# EAGLE design WingboardT (EAGLE 6.2)
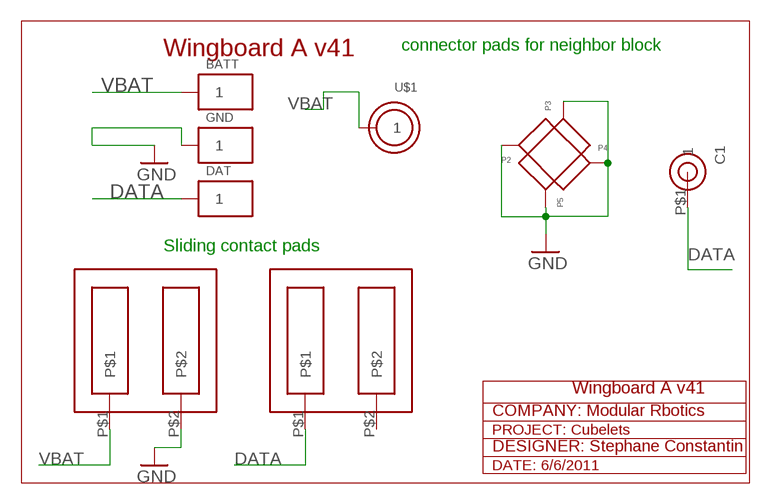
[diagram p0: schematic, sheet 1]

## Parts
BATT  PAD2  [PAD2]
C1  COMM_PIN2  [COMM_PIN2]
DAT  PAD2  [PAD2]
GND  PAD2  [PAD2]
J1  SLIDING_CONTACT  [SLIDING_CONTACT]
J2  SLIDING_CONTACT  [SLIDING_CONTACT]
P2  GND_PAD_WING  [GND_PAD_WING]
P3  GND_PAD_WING  [GND_PAD_WING]
P4  GND_PAD_WING  [GND_PAD_WING]
P5  GND_PAD_WING  [GND_PAD_WING]
U$1  VBAT_CIRCLE  [VBAT_CIRCLE]

## Nets
DATA: C1.P$1 DAT.P$1 J2.P$1
GND: GND.P$1 J1.P$2 P2.P$1 P3.P$1 P4.P$1 P5.P$1
VBAT: BATT.P$1 J1.P$1 U$1.P$1
Unconnected: J2.P$2

## Notes on the sheet
- connector pads for neighbor block
- Wingboard A v41
- Sliding contact pads
- Wingboard A v41
- COMPANY: Modular Rbotics
- PROJECT: Cubelets
- DESIGNER: Stephane Constantin
- DATE: 6/6/2011

## Library data of the parts
BATT DAT GND = roblocks:PAD2
C1 = roblocks:COMM_PIN2
J1 J2 = nev:SLIDING_CONTACT
P2-P5 = roblocks:GND_PAD_WING
U$1 = roblocks:VBAT_CIRCLE

## Board
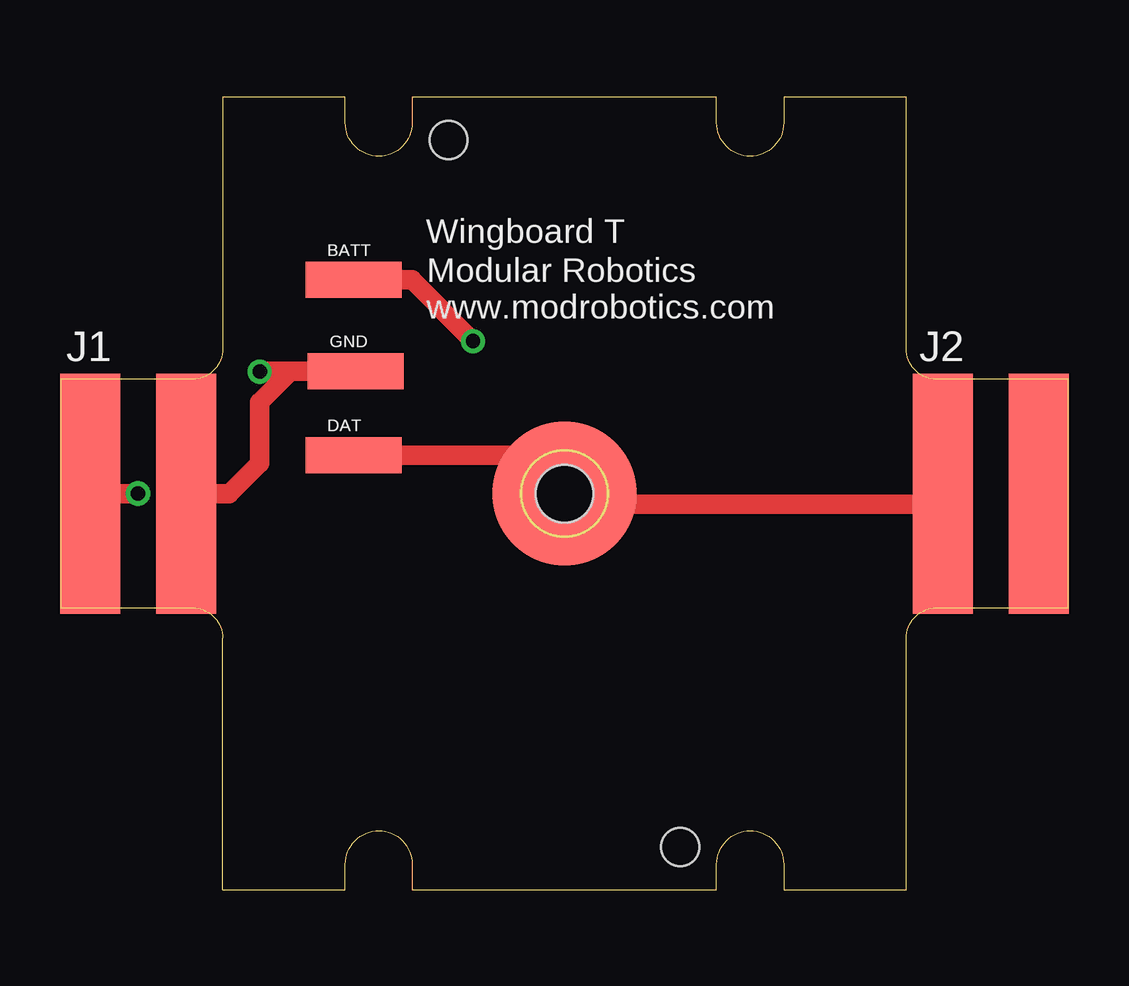
[diagram p1: board, top side]
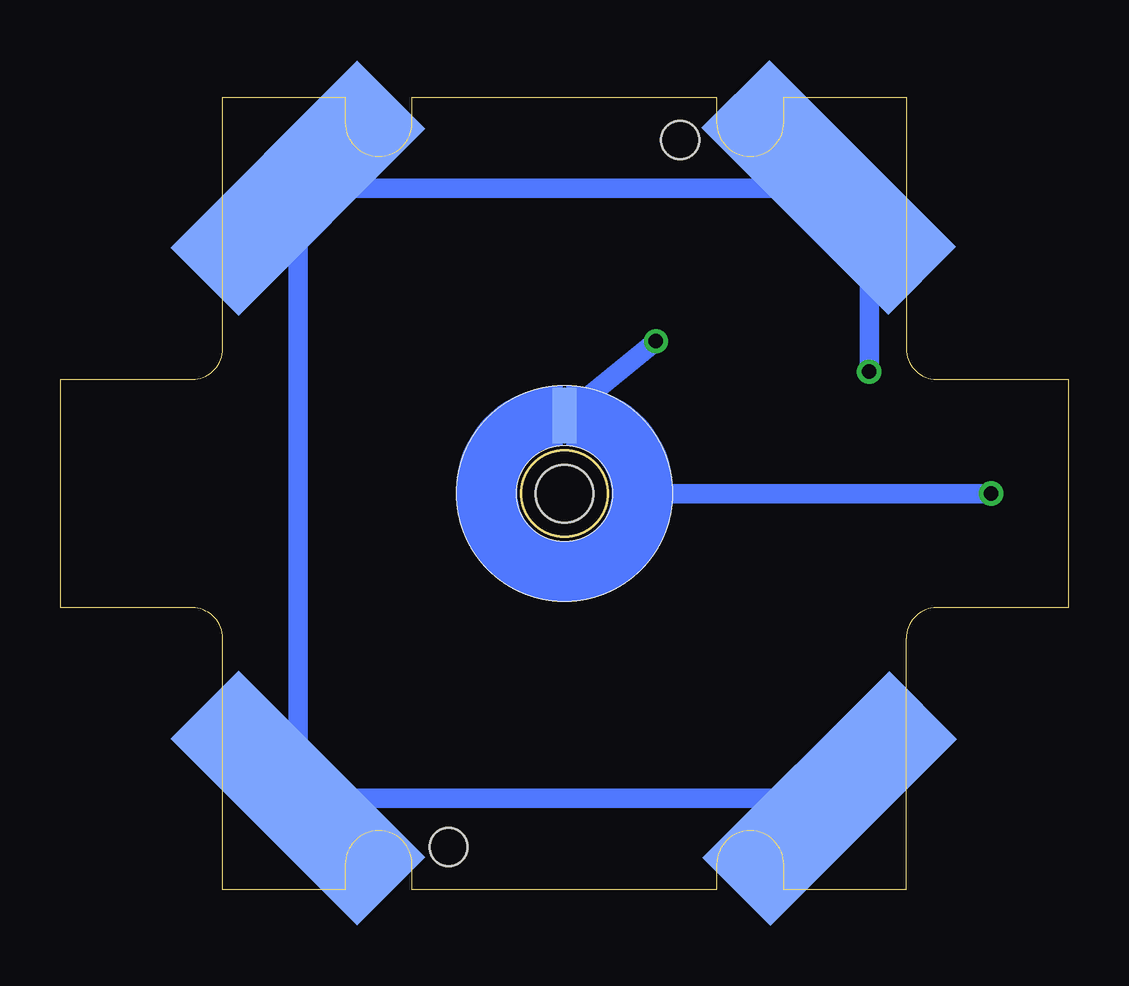
[diagram p2: board, bottom side, seen from below]

Size 42 x 33.02 mm. Coordinates in mm from the lower left corner, seen from the top.
Outline: 6.76,0 6.76,10.48 arc90 5.49,11.75 0,11.75 0,21.27 5.49,21.27 arc90 6.76,22.54 6.76,33.02 11.86,33.02 11.86,31.96 arc180 14.66,31.96 14.66,33.02 27.35,33.02 27.35,31.96 arc180 30.14,31.96 30.14,33.02 35.25,33.02 35.25,22.54 arc90 36.52,21.27 42,21.27 42,11.75 36.52,11.75 arc90 35.25,10.48 35.25,0 30.14,0 30.14,1.06 arc180 27.35,1.06 27.35,0 14.66,0 14.66,1.06 arc180 11.86,1.06 11.86,0 6.76,0
Outline: circle at 21,16.51 radius 1.8
Copper layers (1*16): Top 0.035mm / dielectric 1.5mm / Bottom 0.035mm
Design rules: minimum track width 10mil, minimum drill 24mil, track to track 8mil, track to pad 8mil, pad to pad 8mil, via to via 8mil, smd to smd 8mil, copper to edge 40mil, drill to drill 8mil, minimum pad ring 10mil, minimum via ring 8mil, stop-mask expansion 4mil, vias tented up to drill 26mil, thermal gap 10mil
Holes 1.57 mm at 16.17,31.24 25.83,1.78

### Footprints (pad centres in the part's own frame; a part is rotated, then mirrored left to right if it is on the bottom)
PAD2 = smd 4 x 1.5: P$1 0,0
COMM_PIN2 = smd 6 x 6: P$1 0,0 | hole 2.4: 0,0
SLIDING_CONTACT = smd 2.5 x 10: P$1 -2,0; P$2 2,0
GND_PAD_WING = smd 11 x 4: P$1 0,0
VBAT_CIRCLE = smd 1 x 2.3: P$1 0,3.25

### Placement (x,y rotation side)
BATT  12.2,25.41 0 top
C1  21,16.51 0 top
DAT  12.2,18.11 0 top
GND  12.3,21.61 0 top
J1  3.22,16.51 0 top
J2  38.78,16.51 0 top
P2  32.11,3.82 315 bottom
P3  9.94,3.8 225 bottom
P4  32.11,29.23 45 bottom
P5  9.98,29.27 315 bottom
U$1  21,16.51 0 bottom

### Tracks (layer width: path | path; a pad name or v marks a point on that pad's centre or on a via)
DATA
  Top 0.406: 21,18.11 C1.P$1 | 36.78,16.06 J2.P$1
  Top 0.508: C1.P$1 21.37,16.14 21.37,16.06 19.32,18.11
  Top 0.813: DAT.P$1 21,18.11 | 21.37,16.06 36.78,16.06
GND  (via drill 0.6)
  Top 0.406: GND.P$1 9.59,21.61 | 8.32,21.61 v8.3,21.59
  Top 0.813: 9.59,21.61 8.3,20.32 8.3,17.78 7.03,16.51 J1.P$2 | GND.P$1 8.32,21.61
  Bottom 0.406: 8.3,26.67 P5.P$1 | 9.94,3.82 P3.P$1 | P3.P$1 8.3,3.8 | P3.P$1 32.11,3.8
  Bottom 0.813: v8.3,21.59 8.3,26.67 | 9.98,29.23 P4.P$1 32.11,3.8 | P2.P$1 9.94,3.82
  Bottom 1.778: P5.P$1 9.98,29.23
VBAT  (via drill 0.6)
  Top 0.813: v3.22,16.51 J1.P$1 | BATT.P$1 14.64,25.41 v17.19,22.86
  Bottom 0.406: U$1.P$1 19.17,19.76 17.19,17.78 17.19,16.51
  Bottom 0.813: v17.19,22.86 U$1.P$1 | 17.19,16.51 v3.22,16.51

### Text on the board
tPlace: Wingboard T | Modular Robotics | www.modrobotics.com
_tNames: BATT | GND | DAT